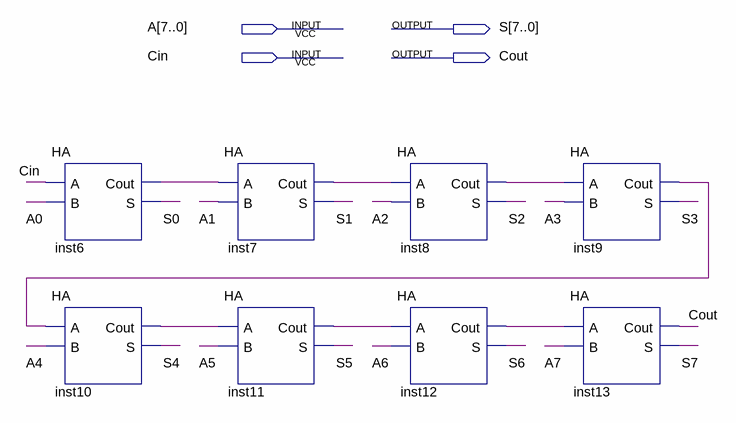
[diagram p0: schematic sheet]
// Quartus schematic INC8.bdf as structural Verilog: 8 symbols, 4 pins
module INC8 (
  input  [7:0] A,
  input  Cin,
  output [7:0] S,
  output Cout
);

  wire inst6_cout, inst7_cout, inst8_cout, inst9_cout, inst10_cout, inst11_cout, inst12_cout;

  HA inst6 (.A(Cin), .B(A[0]), .Cout(inst6_cout), .S(S[0]));
  HA inst10 (.A(inst9_cout), .B(A[4]), .Cout(inst10_cout), .S(S[4]));
  HA inst7 (.A(inst6_cout), .B(A[1]), .Cout(inst7_cout), .S(S[1]));
  HA inst11 (.A(inst10_cout), .B(A[5]), .Cout(inst11_cout), .S(S[5]));
  HA inst8 (.A(inst7_cout), .B(A[2]), .Cout(inst8_cout), .S(S[2]));
  HA inst12 (.A(inst11_cout), .B(A[6]), .Cout(inst12_cout), .S(S[6]));
  HA inst9 (.A(inst8_cout), .B(A[3]), .Cout(inst9_cout), .S(S[3]));
  HA inst13 (.A(inst12_cout), .B(A[7]), .Cout(Cout), .S(S[7]));
endmodule
